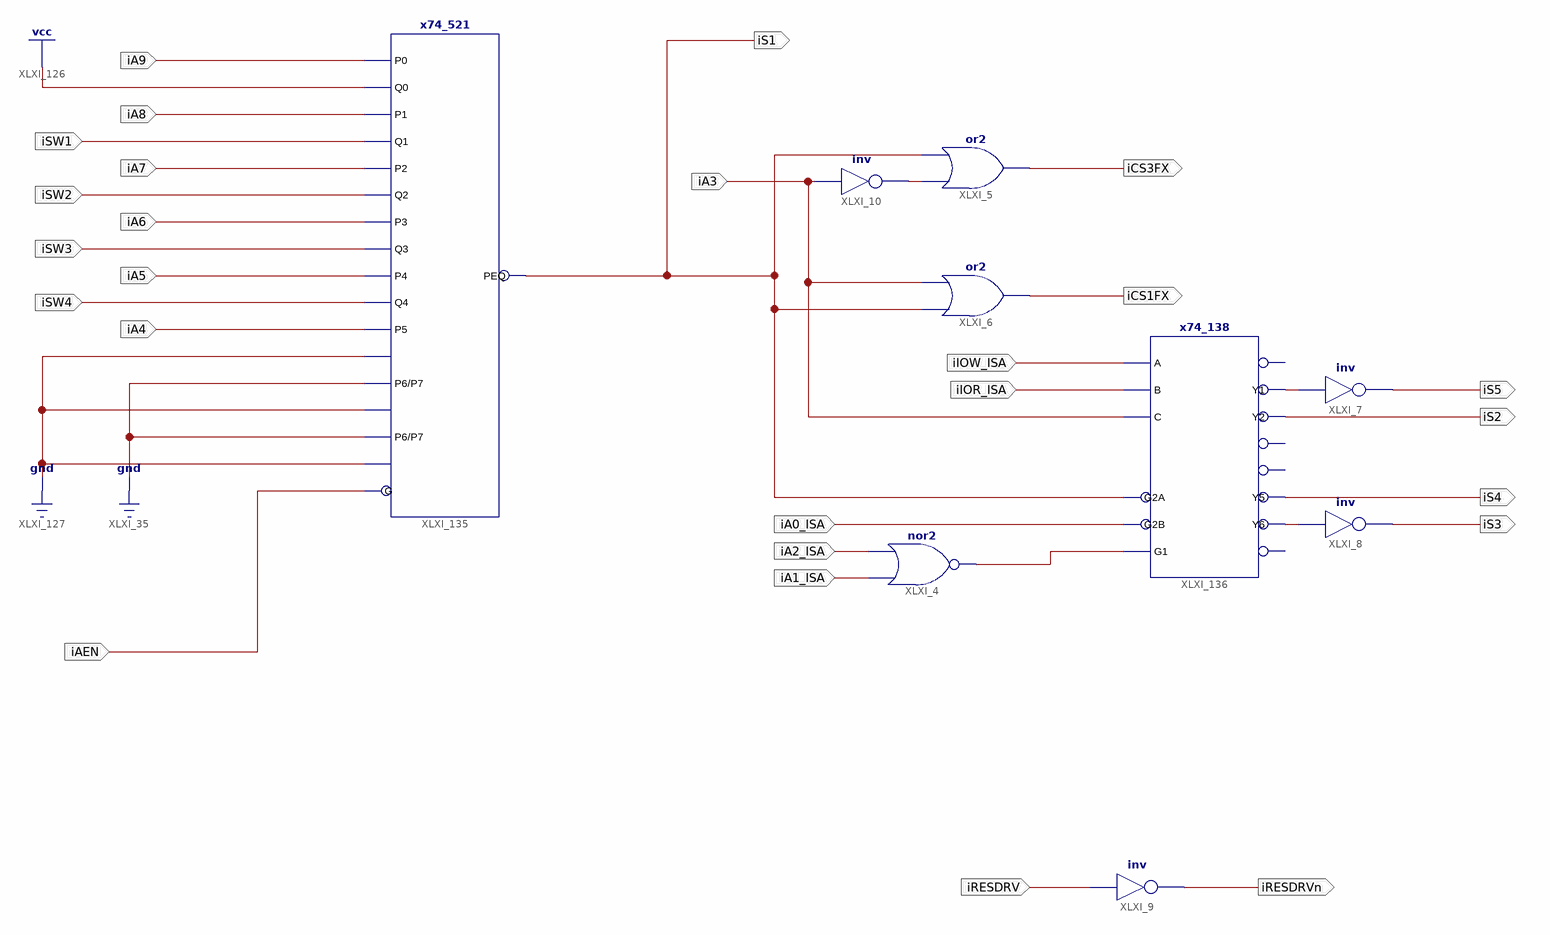
[diagram p0: schematic sheet 1]
// Xilinx ISE schematic IDE_DECODE.sch (xc9500xl) as structural Verilog: 9 symbols, 26 ports
module IDE_DECODE (
  input  iAEN,
  input  iA3,
  input  iIOW_ISA,
  input  iIOR_ISA,
  input  iA0_ISA,
  input  iA9,
  input  iA7,
  input  iA6,
  input  iA5,
  input  iA4,
  input  iSW1,
  input  iSW2,
  input  iSW3,
  input  iSW4,
  input  iA8,
  input  iRESDRV,
  input  iA2_ISA,
  input  iA1_ISA,
  output iS1,
  output iS5,
  output iS4,
  output iS3,
  output iCS3FX,
  output iCS1FX,
  output iRESDRVn,
  output iS2
);

  wire XLXN_1, XLXN_2, XLXN_138, XLXN_231;

  or XLXI_5 (iCS3FX, XLXN_2, iS1);
  or XLXI_6 (iCS1FX, iS1, iA3);
  not XLXI_7 (iS5, XLXN_1);
  not XLXI_10 (XLXN_2, iA3);
  not XLXI_8 (iS3, XLXN_138);
  not XLXI_9 (iRESDRVn, iRESDRV);
  x74_521 XLXI_135 (
    .G(iAEN), .P0(iA9), .P1(iA8), .P2(iA7), .P3(iA6), .P4(iA5), .P5(iA4), .P6(1'b0), .P7(1'b0), .Q0(1'b1),
    .Q1(iSW1), .Q2(iSW2), .Q3(iSW3), .Q4(iSW4), .Q5(1'b0), .Q6(1'b0), .Q7(1'b0), .PEQ(iS1));
  x74_138 XLXI_136 (
    .A(iIOW_ISA), .B(iIOR_ISA), .C(iA3), .G1(XLXN_231), .G2A(iS1), .G2B(iA0_ISA), .Y1(XLXN_1), .Y2(iS2),
    .Y5(iS4), .Y6(XLXN_138));  // open: Y0, Y3, Y4, Y7
  nor XLXI_4 (XLXN_231, iA1_ISA, iA2_ISA);
endmodule
